# Altium project CSI2-WAND_Rev01.PrjPcb
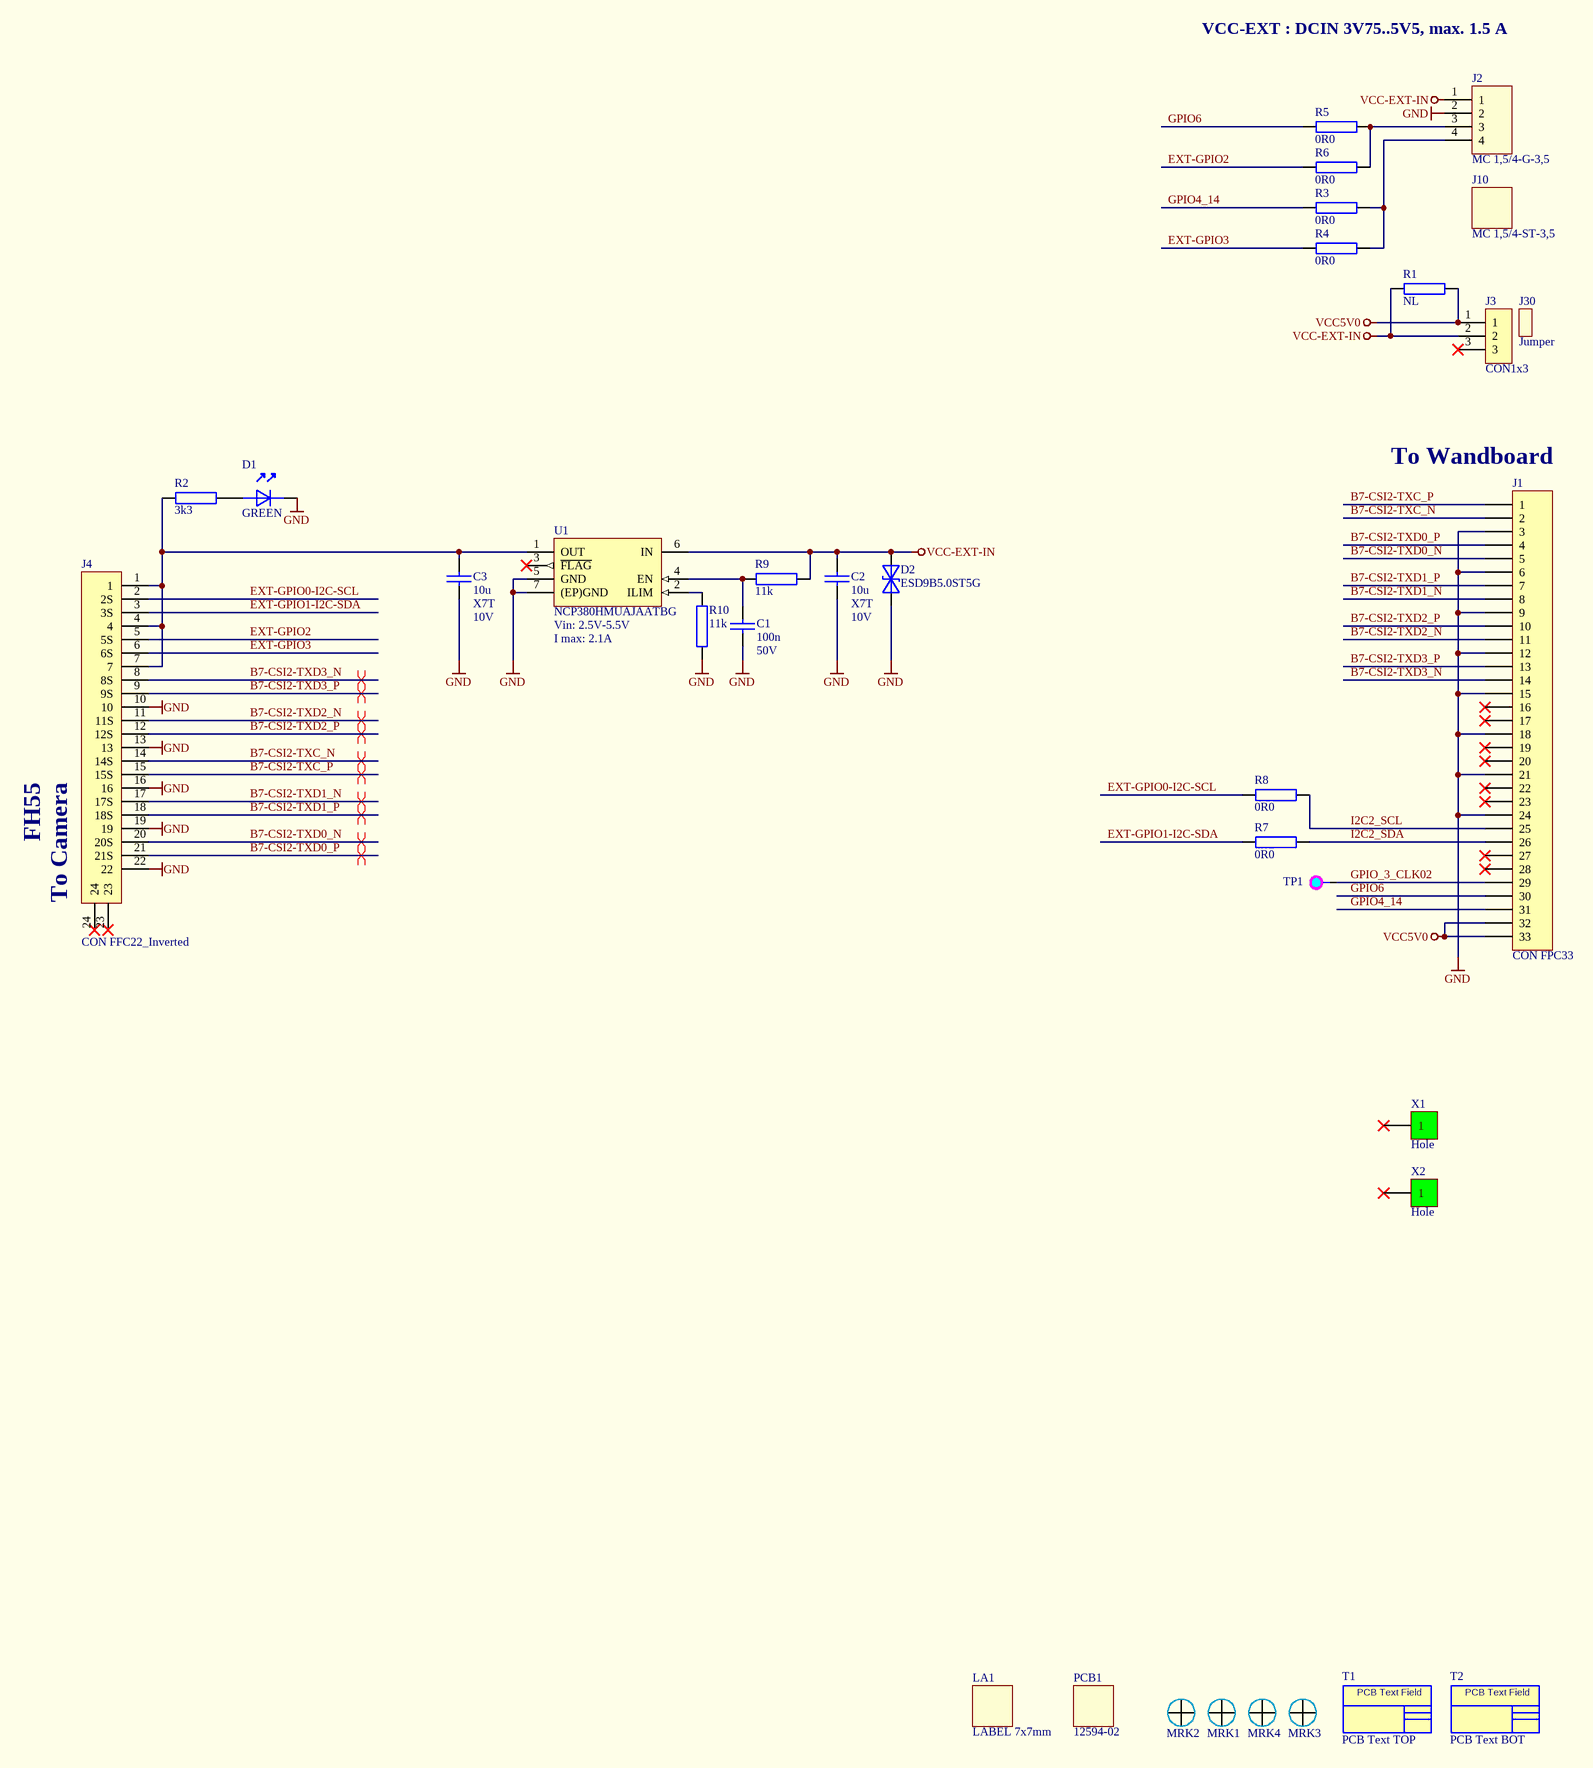
[diagram p0: CSI2-WAND_Rev01.SchDoc]
VariantName: standard; Title: CSI2-WAND_Rev01; RevisionPCB: 01; _ProjectName: CSI2-WAND
1 sheet, 33 parts. Net scope: global (net labels, ports and power ports of the same name join across sheets).
Board file: CSI2-WAND_Rev01.PcbDoc

## Sheet CSI2-WAND_Rev01.SchDoc: CSI2-WAND_Rev01
size A2; PageSetup: Record=PageOptions|CenterHorizontal=True|CenterVertical=True|PrintScale=0.73|XCorrection=1.00|YCorrection=1.00|PrintKind=2|BorderSize=5000000|LeftOffset=0|BottomOffset=0|Orientation=2|PaperLength=1000|PaperWidth=1000|Scale=100|PaperSource=7|PrintQuality=-4|MediaType=1|DitherType=10|PrintScaleMode=1|PaperKind=A3; CheckedBy: OFU; Author: CWA; CompanyName: Allied Vision Technologies GmbH; Address1: Taschenweg 2a; Address2: 07646 Stadtroda; Address3: Germany; Revision: 01; SheetNumber: 1; SheetTotal: 1

### Parts
C1  100n  Voltage: 50V  [C-0603_1.0]
C2  10u  Dielectric: X7T  Voltage: 10V  [C-0603_1.0]
C3  10u  Dielectric: X7T  Voltage: 10V  [C-0603_1.0]
D1  GREEN  [D-0603-LED]
D2  ESD9B5.0ST5G  [D-SOD923]
J1  CON FPC33  [CON33_FLEX_FPC3.5_5- Inverted Pins]  (no BOM)
J2  MC 1,5/4-G-3,5  [CON_MiniCon 4pol 3mm5]
J3  CON1x3  [CON 1x3 RM2.54]
J4  CON FFC22_Inverted  [J-FH55-22S-0.5SH - Inverted Pins]
J10  MC 1,5/4-ST-3,5  (mechanical)
J30  Jumper  [J-JUMPER-2.54]
LA1  LABEL 7x7mm  [PCB LABEL 7x7]
MRK1  Marker Single Layer  [PCB_Marker_Pad_top]  (value not drawn)
MRK2  Marker Single Layer  [PCB_Marker_Pad_top]  (value not drawn)
MRK3  Marker Single Layer  [PCB_Marker_Pad_top]  (value not drawn)
MRK4  Marker Single Layer  [PCB_Marker_Pad_top]  (value not drawn)
PCB1  12594-02  (mechanical)
R1  NL  [R-0603_0.6]
R2  3k3  [R-0603_0.6]
R3  0R0  [R-0603_0.6]
R4  0R0  [R-0603_0.6]
R5  0R0  [R-0603_0.6]
R6  0R0  [R-0603_0.6]
R7  0R0  [R-0603_0.6]
R8  0R0  [R-0603_0.6]
R9  11k  [R-0603_0.6]
R10  11k  [R-0603_0.6]
T1  PCB Text TOP  [PCB TEXTFIELD TOP 2]  (no BOM)
T2  PCB Text BOT  [PCB TEXTFIELD BOT 2]  (no BOM)
TP1  TP  [TP_11_065]  (value not drawn)  (no BOM)
U1  NCP380HMUAJAATBG  Vin: 2.5V-5.5V  I max: 2.1A  [IC-DFN06_2.0x2.0x0.8]
X1  Hole  [HOLE-3.2-6.0-DK]  (no BOM)
X2  Hole  [HOLE-3.2-6.0-DK]  (no BOM)

### Nets
GND: C1.2 C2.2 C3.2 D1.K D2.A J1.3 J1.6 J1.9 J1.12 J1.15 J1.18 J1.21 J1.24 J2.2 J4.10 J4.13 J4.16 J4.19 J4.22 R10.1 U1.5(GND) U1.7((EP)GND)
VCC5V0: J1.32 J1.33 J3.1 R1.1
VCC-EXT-IN: C2.1 D2.K J2.1 J3.2 R1.2 R9.1 U1.6(IN)
B7-CSI2-TXC_N: J1.2 J4.14(14S)
B7-CSI2-TXC_P: J1.1 J4.15(15S)
B7-CSI2-TXD0_N: J1.5 J4.20(20S)
B7-CSI2-TXD0_P: J1.4 J4.21(21S)
B7-CSI2-TXD1_N: J1.8 J4.17(17S)
B7-CSI2-TXD1_P: J1.7 J4.18(18S)
B7-CSI2-TXD2_N: J1.11 J4.11(11S)
B7-CSI2-TXD2_P: J1.10 J4.12(12S)
B7-CSI2-TXD3_N: J1.14 J4.8(8S)
B7-CSI2-TXD3_P: J1.13 J4.9(9S)
EXT-GPIO0-I2C-SCL: J4.2(2S) R8.2
EXT-GPIO1-I2C-SDA: J4.3(3S) R7.2
EXT-GPIO2: J4.5(5S) R6.2
EXT-GPIO3: J4.6(6S) R4.2
GPIO4_14: J1.31 R3.2
GPIO6: J1.30 R5.2
GPIO_3_CLK02: J1.29 TP1.1
I2C2_SCL: J1.25 R8.1
I2C2_SDA: J1.26 R7.1
NetC1_1: C1.1 R9.2 U1.4(EN)
NetC3_1: C3.1 J4.1 J4.4 J4.7 R2.1 U1.1(OUT)
NetD1_A: D1.A R2.2
NetJ2_3: J2.3 R5.1 R6.1
NetJ2_4: J2.4 R3.1 R4.1
NetR10_2: R10.2 U1.2(ILIM)

Not connected (* = marked no-connect by the designer): J1 16* 17* 19* 20* 22* 23* 27* 28*; J3 3*; J4 23* 24*; U1 3(~{FLAG})*; X1 1*; X2 1*

### Layout directives
differential pair: B7-CSI2-TXC_N, B7-CSI2-TXC_P, B7-CSI2-TXD0_N, B7-CSI2-TXD0_P, B7-CSI2-TXD1_N, B7-CSI2-TXD1_P, B7-CSI2-TXD2_N, B7-CSI2-TXD2_P, B7-CSI2-TXD3_N, B7-CSI2-TXD3_P

### Notes on the sheet
- VCC-EXT : DCIN 3V75..5V5, max. 1.5 A
- (near J1) To Wandboard
- (near J4) FH55
- (near J4) To Camera
- Author:
- Title:
- PCB:
- Checked by:
- PCBA:
- 2
- 3
- Confidential
- File:
- Date:
- Page:
- of
- No.
- 1
- Changes
- Rev.:
- Name:
- (in symbol PCB TEXT FIELD BOT) PCB Text Field
- (in symbol PCB TEXT FIELD TOP) PCB Text Field

### Library data of the parts
C1 = C 100N 50V X7R 0603: Capacitor Ceramic SMD/0603/50V/X7R/10%; KHK Part Number: K8340023; Manufacturer: several; Dielectric: X7R; Tolerance: 10%; Manufacturer Part Number: several
C2 C3 = C 10U 10V X7T 0603 125°C: Capacitor Ceramic SMD/0603/10V/X7T/20%/125°C; KHK Part Number: 10509; Manufacturer: several; Tolerance: 20%; Manufacturer Part Number: several
D1 = D LED 0603 green: Chip LED green 430mcd; KHK Part Number: 8172; Manufacturer: Würth; Manufacturer Part Number: 150060GS75000; Current: 20mA; Color: green
D2 = D ESD9B5.0ST5G: DIODE TVS; 400W; 5.8-7.8V; BIDIRECT; KHK Part Number: 7250; Manufacturer: ON Semiconductor; Manufacturer Part Number: ESD9B5.0ST5G
J1 = CON FPC33_FLEXPCB: FPC Connector 0.5mm FLEX PCB
J2 = CON MiniCon 4pol 3mm5: Phoenix MC 1,5/4-G-3,5 MiniCon 4polig 3,5mm; KHK Part Number: 12637; Manufacturer: Phoenix; Manufacturer Part Number: MC 1,5/4-G-3,5
J3 = CON 1x3 2.54: Stiftleiste; 1x3; 2.54mm; gerade; Manufacturer: fischer elektronik; Manufacturer Part Number: SL 11 124 3 G; KHK Part Number: K7600610
J4 = CON FFC22_FH55-22S-0.5SH_Inverted: FFC Connector 0.5mm shielded; KHK Part Number: 10357; Manufacturer: Hirose; Manufacturer Part Number: FH55-22S-0.5SH
J10 = CON MiniCon 4pol 3mm5 ST: Phoenix MC 1,5/4-ST-3,5 MiniCon 4polig 3,5mm; KHK Part Number: 12635; Manufacturer: Phoenix; Manufacturer Part Number: MC 1,5/4-ST-3,5
J30 = CON Jumper 2.54mm: CON/JUMPER/STC02SYAN; 2-pin; 2.54mm; 3A; FEMALE; VERTICAL; BLACK; KHK Part Number: 13444; Manufacturer: several; Manufacturer Part Number: several
LA1 = PCB LABEL 7x7: Manufacturer: several; Manufacturer Part Number: several
MRK1-MRK4 = PCB Marker Pad Single Layer: Position Marker for PCBs
PCB1 = PCB: PCB ML04; Manufacturer: several; KHK Part Number: 12594-02; Manufacturer Part Number: 12594-02
R1 = R X 0603: Standard Resistor SMD/0603/1%/100mW/TK100; Temperature Coefficient: TK100; Tolerance: 1%
R2 = R 3K3 1% 0603: Standard Resistor SMD/0603/1%/100mW/TK100; KHK Part Number: K8250070; Manufacturer: several; Tolerance: 1%; Manufacturer Part Number: several
R3-R8 = R 0R0 1% 0603: Standard Resistor SMD/0603/1%/100mW/TK100; KHK Part Number: K8250041; Manufacturer: several; Tolerance: 1%; Manufacturer Part Number: several; Temperature Coefficient: *
R9 R10 = R 11K 1% 0603: Standard Resistor SMD/0603/1%/100mW/TK100; KHK Part Number: K8250147; Manufacturer: several; Tolerance: 1%; Temperature Coefficient: TK100; Manufacturer Part Number: several
T1 = PCB TEXT FIELD TOP: PCB Textfield TOP
T2 = PCB TEXT FIELD BOT: PCB Textfield BOT
TP1 = TP_11_065: Testpoint: Pad=1,1mm; Hole=0,65mm
U1 = IC  NCP380HMUAJAATBG: IC/PWR/LOADSW;1V2-5V5;3A;0R03/WLCSP6/1x1.5x0.63mm; KHK Part Number: 13676; Manufacturer: onsemi; Manufacturer Part Number: NCP380HMUAJAATBG
X1 X2 = PCB HOLE M3-6-DK: HOLE M3

## Assembly variants
standard: all parts fitted